# Altium project SBC RK3368.PrjPcb
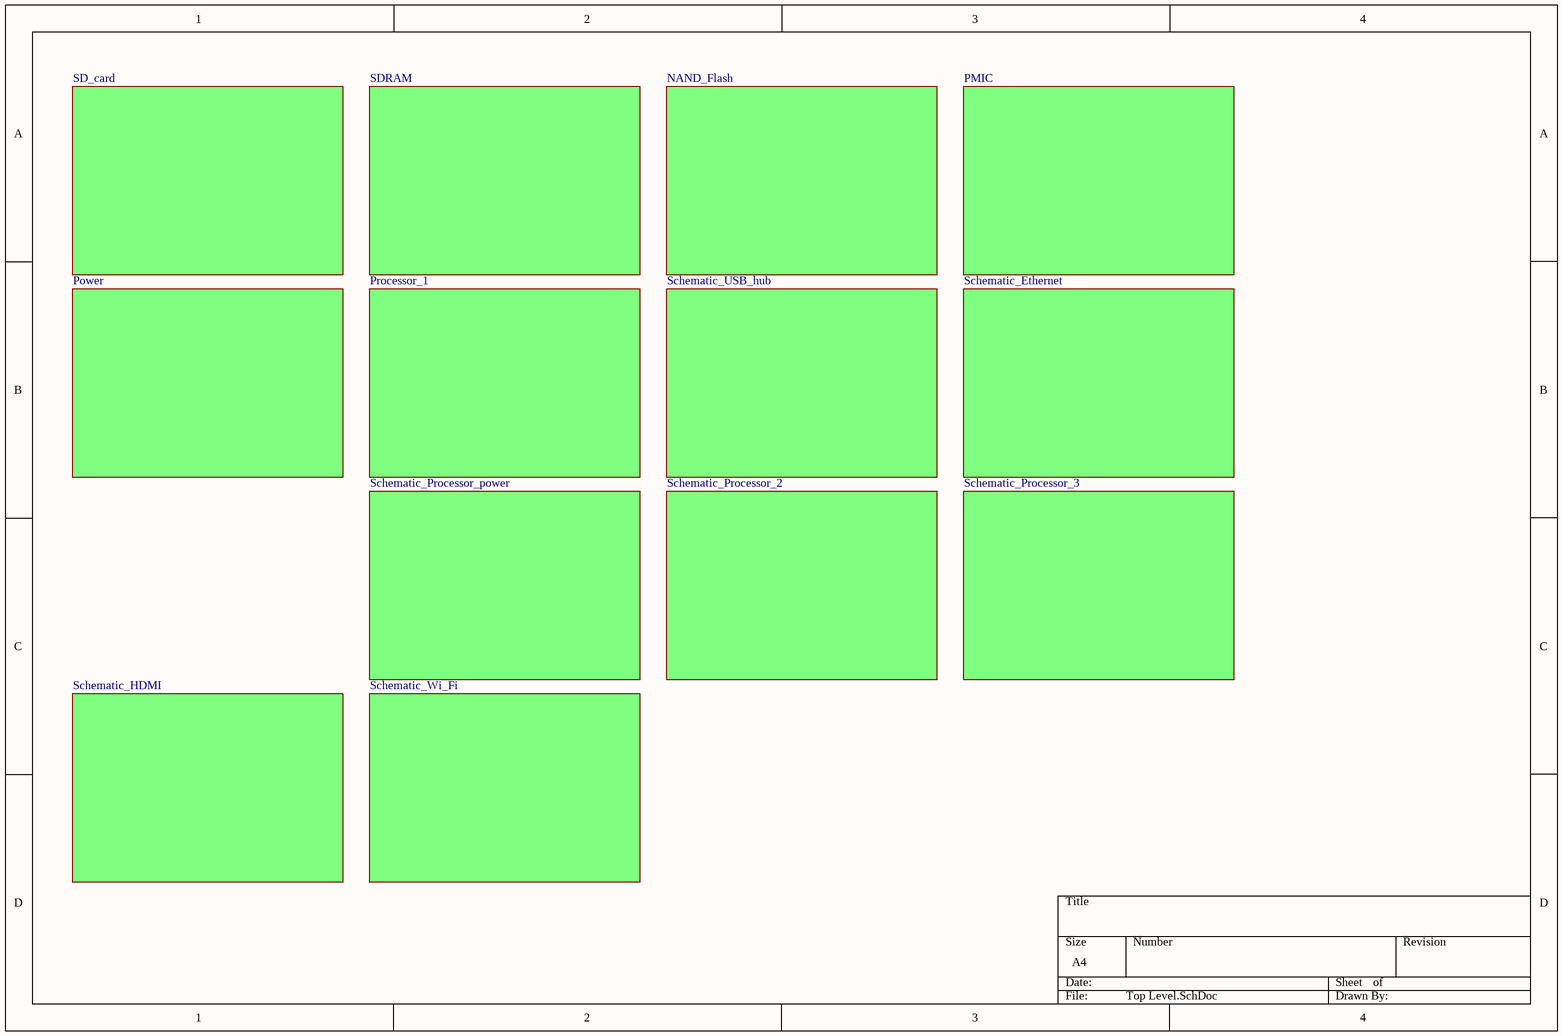
[diagram p0: Top Level.SchDoc]
14 sheets, 49 parts. Net scope: global (net labels, ports and power ports of the same name join across sheets).
Board file: SBC A33.PcbDoc
Sheets:
  Top Level.SchDoc
    SD_card = SD_card.SchDoc
    SDRAM = SDRAM.SchDoc
    NAND_Flash = NAND_Flash.SchDoc
    PMIC = PMIC.SchDoc
    Power = Power.SchDoc
    Processor_1 = Processor_1.SchDoc
    Schematic_USB_hub = USB_hub.SchDoc
    Schematic_Ethernet = Ethernet.SchDoc
    Schematic_Processor_power = Processor_power.SchDoc
    Schematic_Processor_2 = Processor_2.SchDoc
    Schematic_Processor_3 = Processor_3.SchDoc
    Schematic_HDMI = HDMI.SchDoc
    Schematic_Wi_Fi = Wi_Fi.SchDoc

## Sheet Top Level.SchDoc
size A4; SheetNumber: 1; SheetTotal: 14

### Sub-sheets
NAND_Flash = NAND_Flash.SchDoc: no entries
PMIC = PMIC.SchDoc: no entries
Power = Power.SchDoc: no entries
Processor_1 = Processor_1.SchDoc: no entries
Schematic_Ethernet = Ethernet.SchDoc: no entries
Schematic_HDMI = HDMI.SchDoc: no entries
Schematic_Processor_2 = Processor_2.SchDoc: no entries
Schematic_Processor_3 = Processor_3.SchDoc: no entries
Schematic_Processor_power = Processor_power.SchDoc: no entries
Schematic_USB_hub = USB_hub.SchDoc: no entries
Schematic_Wi_Fi = Wi_Fi.SchDoc: no entries
SD_card = SD_card.SchDoc: no entries
SDRAM = SDRAM.SchDoc: no entries

## Sheet SD_card.SchDoc
size 209 x 297 mm; CmpIndex: 71; SymIndex: 29
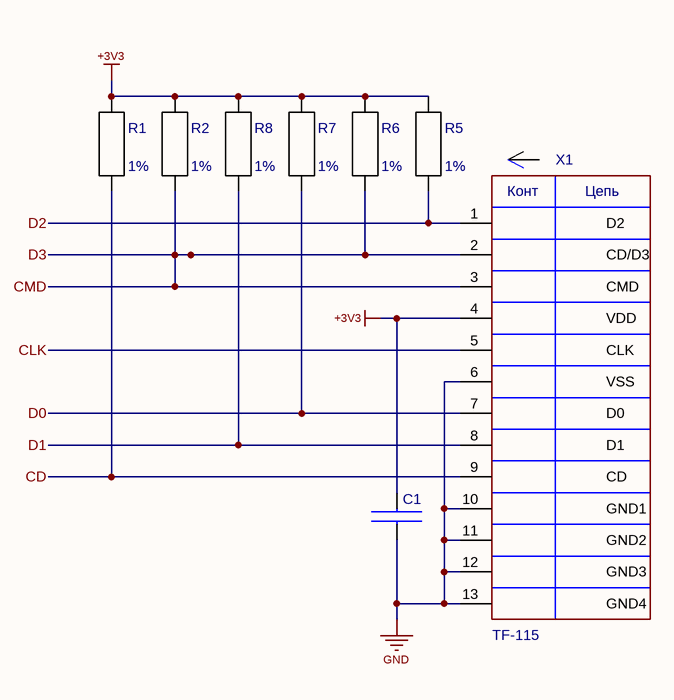
[diagram p1: SD_card.SchDoc]

### Parts
C1  0402-0.1uF-50V-10%-X7R  (value not drawn)
R1  Tolerance: 1%  (hidden comment: 0402-10k-1%-1/16 W-100ppm)
R2  Tolerance: 1%  (hidden comment: 0402-10k-1%-1/16 W-100ppm)
R5  Tolerance: 1%  (hidden comment: 0402-100k-1%-1/16 W-100ppm)
R6  Tolerance: 1%  (hidden comment: 0402-100k-1%-1/16 W-100ppm)
R7  Tolerance: 1%  (hidden comment: 0402-100k-1%-1/16 W-100ppm)
R8  Tolerance: 1%  (hidden comment: 0402-100k-1%-1/16 W-100ppm)
X1  TF-115

### Nets
+3V3: C1.2 R1.2 R2.2 R5.2 R6.2 R7.2 R8.2 X1.4(VDD)
GND: C1.1 X1.6(VSS) X1.10(GND1) X1.11(GND2) X1.12(GND3) X1.13(GND4)
CD: R1.1 X1.9(CD)
CLK: X1.5(CLK)
CMD: R2.1 R6.1 X1.2(CD/D3) X1.3(CMD)  [also labelled D3]
D0: R7.1 X1.7(D0)
D1: R8.1 X1.8(D1)
D2: R5.1 X1.1(D2)

### Notes on the sheet
- Лист
- Изм.
- № Докум.
- Подп.
- Дата
- (in symbol TF-115) Конт; Цепь

### Library data of the parts
C1 = 0402-0.1uF-50V-10%-X7R: Cell Name: 0402_CAPC100X50X55L25N; CmpIndex: 9; DXDB_LIBNAME: Capacitors Ceramic SMD; Ref Designator: C1; SymIndex: 25; Tolerance: 10%; Orientation: 1 = 1; Part Label: 0402-0.1uF-50V-10%-X7R; Part Name: 0402-0.1uF-50V-10%-X7R; Part Number NP: 0402-0.1uF-50V-10%-X7R; Part Number: 0402-0.1uF-50V-10%-X7R
R1 = 0402-10k-1%-1/16 W-100ppm: Cell Name: 0402_RESC100X50X35L25N; CmpIndex: 10; DXDB_LIBNAME: Resistors Surface Mount; Ref Designator: R1; SymIndex: 13; Orientation: 1 = 1; Part Label: 0402-10k-1%-1/16 W-100ppm; Part Name: 0402-10k-1%-1/16 W-100ppm; Part Number NP: 0402-10k-1%-1/16 W-100ppm; Part Number: 0402-10k-1%-1/16 W-100ppm
R2 = 0402-10k-1%-1/16 W-100ppm: Cell Name: 0402_RESC100X50X35L25N; CmpIndex: 11; DXDB_LIBNAME: Resistors Surface Mount; Ref Designator: R2; SymIndex: 13; Orientation: 1 = 1; Part Label: 0402-10k-1%-1/16 W-100ppm; Part Name: 0402-10k-1%-1/16 W-100ppm; Part Number NP: 0402-10k-1%-1/16 W-100ppm; Part Number: 0402-10k-1%-1/16 W-100ppm
R5 = 0402-100k-1%-1/16 W-100ppm: Cell Name: 0402_RESC100X50X35L25N; CmpIndex: 12; DXDB_LIBNAME: Resistors Surface Mount; Ref Designator: R5; SymIndex: 13; Orientation: 1 = 1; Part Label: 0402-100k-1%-1/16 W-100ppm; Part Name: 0402-100k-1%-1/16 W-100ppm; Part Number NP: 0402-100k-1%-1/16 W-100ppm; Part Number: 0402-100k-1%-1/16 W-100ppm
R6 = 0402-100k-1%-1/16 W-100ppm: Cell Name: 0402_RESC100X50X35L25N; CmpIndex: 13; DXDB_LIBNAME: Resistors Surface Mount; Ref Designator: R6; Orientation: 1 = 1; Part Label: 0402-100k-1%-1/16 W-100ppm; Part Name: 0402-100k-1%-1/16 W-100ppm; Part Number NP: 0402-100k-1%-1/16 W-100ppm; Part Number: 0402-100k-1%-1/16 W-100ppm; SymIndex: 13
R7 = 0402-100k-1%-1/16 W-100ppm: Cell Name: 0402_RESC100X50X35L25N; CmpIndex: 14; DXDB_LIBNAME: Resistors Surface Mount; Ref Designator: R7; SymIndex: 13; Orientation: 1 = 1; Part Label: 0402-100k-1%-1/16 W-100ppm; Part Name: 0402-100k-1%-1/16 W-100ppm; Part Number NP: 0402-100k-1%-1/16 W-100ppm; Part Number: 0402-100k-1%-1/16 W-100ppm
R8 = 0402-100k-1%-1/16 W-100ppm: Cell Name: 0402_RESC100X50X35L25N; CmpIndex: 15; DXDB_LIBNAME: Resistors Surface Mount; Ref Designator: R8; SymIndex: 13; Orientation: 1 = 1; Part Label: 0402-100k-1%-1/16 W-100ppm; Part Name: 0402-100k-1%-1/16 W-100ppm; Part Number NP: 0402-100k-1%-1/16 W-100ppm; Part Number: 0402-100k-1%-1/16 W-100ppm
X1 = TF-115: Cell Name: TF-115 SD card; CmpIndex: 0; Ref Designator: X1; Orientation: 0 = 0; Part Label: TF-115; Part Name: TF-115; Part Number: TF-115; SymIndex: 0

## Sheet SDRAM.SchDoc
size 297 x 420 mm; CmpIndex: 72; SymIndex: 41
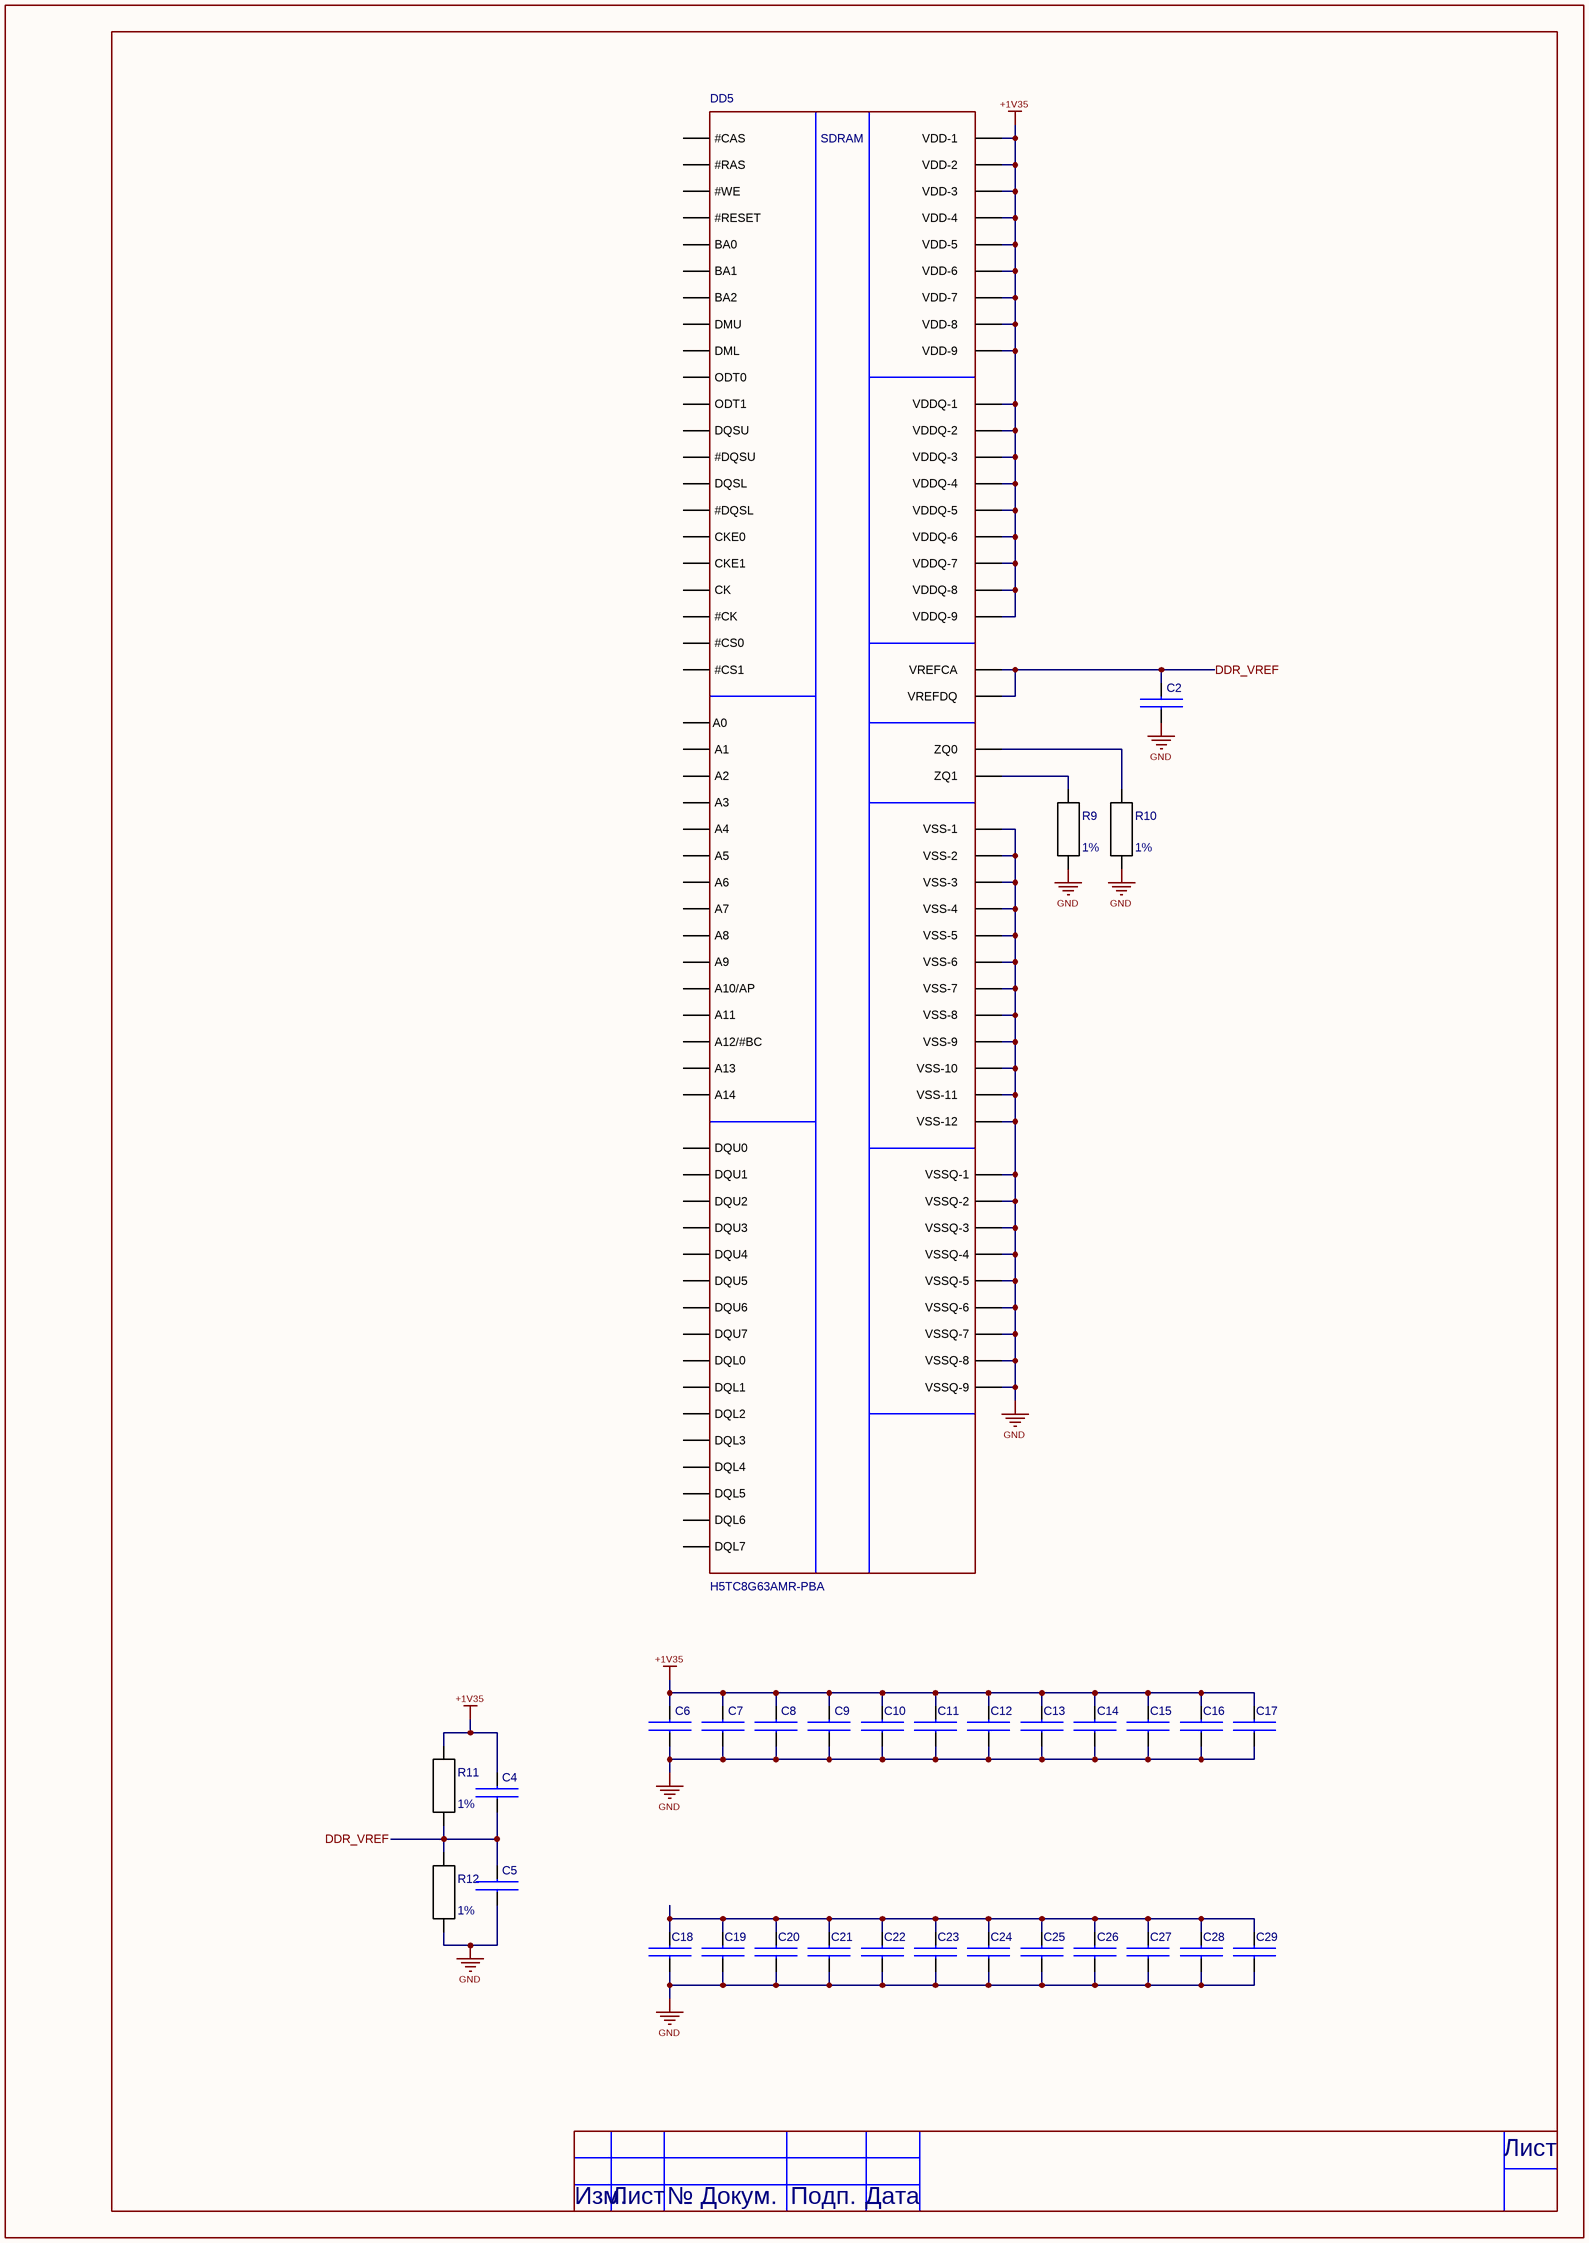
[diagram p2: SDRAM.SchDoc]

### Parts
C2  0402-0.1uF-50V-10%-X7R  (value not drawn)
C4  0402-0.1uF-50V-10%-X7R  (value not drawn)
C5  0402-0.1uF-50V-10%-X7R  (value not drawn)
C6  0402-0.1uF-50V-10%-X7R  (value not drawn)
C7  0402-0.1uF-50V-10%-X7R  (value not drawn)
C8  0402-0.1uF-50V-10%-X7R  (value not drawn)
C9  0402-0.1uF-50V-10%-X7R  (value not drawn)
C10  0402-0.1uF-50V-10%-X7R  (value not drawn)
C11  0402-0.1uF-50V-10%-X7R  (value not drawn)
C12  0402-0.1uF-50V-10%-X7R  (value not drawn)
C13  0402-0.1uF-50V-10%-X7R  (value not drawn)
C14  0402-0.1uF-50V-10%-X7R  (value not drawn)
C15  0402-0.1uF-50V-10%-X7R  (value not drawn)
C16  0402-0.1uF-50V-10%-X7R  (value not drawn)
C17  0402-0.1uF-50V-10%-X7R  (value not drawn)
C18  0402-0.1uF-50V-10%-X7R  (value not drawn)
C19  0402-0.1uF-50V-10%-X7R  (value not drawn)
C20  0402-0.1uF-50V-10%-X7R  (value not drawn)
C21  0402-0.1uF-50V-10%-X7R  (value not drawn)
C22  0402-0.1uF-50V-10%-X7R  (value not drawn)
C23  0402-0.1uF-50V-10%-X7R  (value not drawn)
C24  0402-0.1uF-50V-10%-X7R  (value not drawn)
C25  0402-0.1uF-50V-10%-X7R  (value not drawn)
C26  0402-0.1uF-50V-10%-X7R  (value not drawn)
C27  0402-0.1uF-50V-10%-X7R  (value not drawn)
C28  0402-0.1uF-50V-10%-X7R  (value not drawn)
C29  0402-0.1uF-50V-10%-X7R  (value not drawn)
DD5  H5TC8G63AMR-PBA
R9  Tolerance: 1%  (hidden comment: 0402-243R-1%-1/16 W-100ppm)
R10  Tolerance: 1%  (hidden comment: 0402-243R-1%-1/16 W-100ppm)
R11  Tolerance: 1%  (hidden comment: 0402-2k-1%-1/16 W-100ppm)
R12  Tolerance: 1%  (hidden comment: 0402-2k-1%-1/16 W-100ppm)

### Nets
+1V35: C4.2 C6.2 C7.2 C8.2 C9.2 C10.2 C11.2 C12.2 C13.2 C14.2 C15.2 C16.2 C17.2 DD5.A1(VDDQ-1) DD5.A8(VDDQ-6) DD5.B2(VDD-3) DD5.C1(VDDQ-2) DD5.C9(VDDQ-7) DD5.D2(VDDQ-4) DD5.D9(VDD-7) DD5.E9(VDDQ-8) DD5.F1(VDDQ-3) DD5.G7(VDD-5) DD5.H2(VDDQ-5) DD5.H9(VDDQ-9) DD5.K2(VDD-4) DD5.K8(VDD-6) DD5.N1(VDD-1) DD5.N9(VDD-8) DD5.R1(VDD-2) DD5.R9(VDD-9) R11.2
GND: C2.1 C5.1 C6.1 C7.1 C8.1 C9.1 C10.1 C11.1 C12.1 C13.1 C14.1 C15.1 C16.1 C17.1 C18.1 C19.1 C20.1 C21.1 C22.1 C23.1 C24.1 C25.1 C26.1 C27.1 C28.1 C29.1 DD5.A9(VSS-9) DD5.B1(VSSQ-1) DD5.B3(VSS-6) DD5.B9(VSSQ-7) DD5.D1(VSSQ-2) DD5.D8(VSSQ-5) DD5.E1(VSS-1) DD5.E2(VSSQ-4) DD5.E8(VSSQ-6) DD5.F9(VSSQ-8) DD5.G1(VSSQ-3) DD5.G8(VSS-7) DD5.G9(VSSQ-9) DD5.J2(VSS-5) DD5.J8(VSS-8) DD5.M1(VSS-2) DD5.M9(VSS-10) DD5.P1(VSS-3) DD5.P9(VSS-11) DD5.T1(VSS-4) DD5.T9(VSS-12) R9.2 R10.2 R12.1
DDR_VREF: C2.2 C4.1 C5.2 DD5.H1(VREFDQ) DD5.M8(VREFCA) R11.1 R12.2
NetC18_2: C18.2 C19.2 C20.2 C21.2 C22.2 C23.2 C24.2 C25.2 C26.2 C27.2 C28.2 C29.2
NetDD5_L8: DD5.L8(ZQ0) R10.1
NetDD5_L9: DD5.L9(ZQ1) R9.1

Not connected (* = marked no-connect by the designer): DD5 A2(DQU5) A3(DQU7) A7(DQU4) B7(#DQSU) B8(DQU6) C2(DQU3) C3(DQU1) C7(DQSU) C8(DQU2) D3(DMU) D7(DQU0) E3(DQL0) E7(DML) F2(DQL2) F3(DQSL) F7(DQL1) F8(DQL3) G2(DQL6) G3(#DQSL) H3(DQL4) H7(DQL7) H8(DQL5) J1(ODT1) J3(#RAS) J7(CK) J9(CKE1) K1(ODT0) K3(#CAS) K7(#CK) K9(CKE0) L1(#CS1) L2(#CS0) L3(#WE) L7(A10/AP) M2(BA0) M3(BA2) N2(A3) N3(A0) N7(A12/#BC) N8(BA1) P2(A5) P3(A2) P7(A1) P8(A4) R2(A7) R3(A9) R7(A11) R8(A6) T2(#RESET) T3(A13) T7(A14) T8(A8)

### Notes on the sheet
- Лист
- Изм.
- № Докум.
- Подп.
- Дата
- (in symbol H5TC8G63AMR-PBA) SDRAM

### Library data of the parts
C2 = 0402-0.1uF-50V-10%-X7R: Cell Name: 0402_CAPC100X50X55L25N; CmpIndex: 25; DXDB_LIBNAME: Capacitors Ceramic SMD; Ref Designator: C2; Tolerance: 10%; Orientation: 7 = 7; Part Label: 0402-0.1uF-50V-10%-X7R; Part Name: 0402-0.1uF-50V-10%-X7R; Part Number NP: 0402-0.1uF-50V-10%-X7R; Part Number: 0402-0.1uF-50V-10%-X7R; SymIndex: 25
C4 = 0402-0.1uF-50V-10%-X7R: Cell Name: 0402_CAPC100X50X55L25N; CmpIndex: 34; DXDB_LIBNAME: Capacitors Ceramic SMD; Ref Designator: C4; SymIndex: 25; Tolerance: 10%; Orientation: 1 = 1; Part Label: 0402-0.1uF-50V-10%-X7R; Part Name: 0402-0.1uF-50V-10%-X7R; Part Number NP: 0402-0.1uF-50V-10%-X7R; Part Number: 0402-0.1uF-50V-10%-X7R
C5 = 0402-0.1uF-50V-10%-X7R: Cell Name: 0402_CAPC100X50X55L25N; CmpIndex: 35; DXDB_LIBNAME: Capacitors Ceramic SMD; Ref Designator: C5; SymIndex: 25; Tolerance: 10%; Orientation: 1 = 1; Part Label: 0402-0.1uF-50V-10%-X7R; Part Name: 0402-0.1uF-50V-10%-X7R; Part Number NP: 0402-0.1uF-50V-10%-X7R; Part Number: 0402-0.1uF-50V-10%-X7R
C6 = 0402-0.1uF-50V-10%-X7R: Cell Name: 0402_CAPC100X50X55L25N; CmpIndex: 43; DXDB_LIBNAME: Capacitors Ceramic SMD; Ref Designator: C6; SymIndex: 25; Tolerance: 10%; Orientation: 1 = 1; Part Label: 0402-0.1uF-50V-10%-X7R; Part Name: 0402-0.1uF-50V-10%-X7R; Part Number NP: 0402-0.1uF-50V-10%-X7R; Part Number: 0402-0.1uF-50V-10%-X7R
C7 = 0402-0.1uF-50V-10%-X7R: Cell Name: 0402_CAPC100X50X55L25N; CmpIndex: 46; DXDB_LIBNAME: Capacitors Ceramic SMD; Ref Designator: C7; SymIndex: 25; Tolerance: 10%; Orientation: 1 = 1; Part Label: 0402-0.1uF-50V-10%-X7R; Part Name: 0402-0.1uF-50V-10%-X7R; Part Number NP: 0402-0.1uF-50V-10%-X7R; Part Number: 0402-0.1uF-50V-10%-X7R
C8 = 0402-0.1uF-50V-10%-X7R: Cell Name: 0402_CAPC100X50X55L25N; CmpIndex: 47; DXDB_LIBNAME: Capacitors Ceramic SMD; Ref Designator: C8; SymIndex: 25; Tolerance: 10%; Orientation: 1 = 1; Part Label: 0402-0.1uF-50V-10%-X7R; Part Name: 0402-0.1uF-50V-10%-X7R; Part Number NP: 0402-0.1uF-50V-10%-X7R; Part Number: 0402-0.1uF-50V-10%-X7R
C9 = 0402-0.1uF-50V-10%-X7R: Cell Name: 0402_CAPC100X50X55L25N; CmpIndex: 48; DXDB_LIBNAME: Capacitors Ceramic SMD; Ref Designator: C9; SymIndex: 25; Tolerance: 10%; Orientation: 1 = 1; Part Label: 0402-0.1uF-50V-10%-X7R; Part Name: 0402-0.1uF-50V-10%-X7R; Part Number NP: 0402-0.1uF-50V-10%-X7R; Part Number: 0402-0.1uF-50V-10%-X7R
C10 = 0402-0.1uF-50V-10%-X7R: Cell Name: 0402_CAPC100X50X55L25N; CmpIndex: 49; DXDB_LIBNAME: Capacitors Ceramic SMD; Ref Designator: C10; SymIndex: 25; Tolerance: 10%; Orientation: 1 = 1; Part Label: 0402-0.1uF-50V-10%-X7R; Part Name: 0402-0.1uF-50V-10%-X7R; Part Number NP: 0402-0.1uF-50V-10%-X7R; Part Number: 0402-0.1uF-50V-10%-X7R
C11 = 0402-0.1uF-50V-10%-X7R: Cell Name: 0402_CAPC100X50X55L25N; CmpIndex: 50; DXDB_LIBNAME: Capacitors Ceramic SMD; Ref Designator: C11; SymIndex: 25; Tolerance: 10%; Orientation: 1 = 1; Part Label: 0402-0.1uF-50V-10%-X7R; Part Name: 0402-0.1uF-50V-10%-X7R; Part Number NP: 0402-0.1uF-50V-10%-X7R; Part Number: 0402-0.1uF-50V-10%-X7R
C12 = 0402-0.1uF-50V-10%-X7R: Cell Name: 0402_CAPC100X50X55L25N; CmpIndex: 56; DXDB_LIBNAME: Capacitors Ceramic SMD; Ref Designator: C12; SymIndex: 25; Tolerance: 10%; Orientation: 1 = 1; Part Label: 0402-0.1uF-50V-10%-X7R; Part Name: 0402-0.1uF-50V-10%-X7R; Part Number NP: 0402-0.1uF-50V-10%-X7R; Part Number: 0402-0.1uF-50V-10%-X7R
C13 = 0402-0.1uF-50V-10%-X7R: Cell Name: 0402_CAPC100X50X55L25N; CmpIndex: 55; DXDB_LIBNAME: Capacitors Ceramic SMD; Ref Designator: C13; SymIndex: 25; Tolerance: 10%; Orientation: 1 = 1; Part Label: 0402-0.1uF-50V-10%-X7R; Part Name: 0402-0.1uF-50V-10%-X7R; Part Number NP: 0402-0.1uF-50V-10%-X7R; Part Number: 0402-0.1uF-50V-10%-X7R
C14 = 0402-0.1uF-50V-10%-X7R: Cell Name: 0402_CAPC100X50X55L25N; CmpIndex: 54; DXDB_LIBNAME: Capacitors Ceramic SMD; Ref Designator: C14; SymIndex: 25; Tolerance: 10%; Orientation: 1 = 1; Part Label: 0402-0.1uF-50V-10%-X7R; Part Name: 0402-0.1uF-50V-10%-X7R; Part Number NP: 0402-0.1uF-50V-10%-X7R; Part Number: 0402-0.1uF-50V-10%-X7R
C15 = 0402-0.1uF-50V-10%-X7R: Cell Name: 0402_CAPC100X50X55L25N; CmpIndex: 53; DXDB_LIBNAME: Capacitors Ceramic SMD; Ref Designator: C15; SymIndex: 25; Tolerance: 10%; Orientation: 1 = 1; Part Label: 0402-0.1uF-50V-10%-X7R; Part Name: 0402-0.1uF-50V-10%-X7R; Part Number NP: 0402-0.1uF-50V-10%-X7R; Part Number: 0402-0.1uF-50V-10%-X7R
C16 = 0402-0.1uF-50V-10%-X7R: Cell Name: 0402_CAPC100X50X55L25N; CmpIndex: 52; DXDB_LIBNAME: Capacitors Ceramic SMD; Ref Designator: C16; SymIndex: 25; Tolerance: 10%; Orientation: 1 = 1; Part Label: 0402-0.1uF-50V-10%-X7R; Part Name: 0402-0.1uF-50V-10%-X7R; Part Number NP: 0402-0.1uF-50V-10%-X7R; Part Number: 0402-0.1uF-50V-10%-X7R
C17 = 0402-0.1uF-50V-10%-X7R: Cell Name: 0402_CAPC100X50X55L25N; CmpIndex: 51; DXDB_LIBNAME: Capacitors Ceramic SMD; Ref Designator: C17; SymIndex: 25; Tolerance: 10%; Orientation: 1 = 1; Part Label: 0402-0.1uF-50V-10%-X7R; Part Name: 0402-0.1uF-50V-10%-X7R; Part Number NP: 0402-0.1uF-50V-10%-X7R; Part Number: 0402-0.1uF-50V-10%-X7R
C18 = 0402-0.1uF-50V-10%-X7R: Cell Name: 0402_CAPC100X50X55L25N; CmpIndex: 70; DXDB_LIBNAME: Capacitors Ceramic SMD; Ref Designator: C18; SymIndex: 25; Tolerance: 10%; Orientation: 1 = 1; Part Label: 0402-0.1uF-50V-10%-X7R; Part Name: 0402-0.1uF-50V-10%-X7R; Part Number NP: 0402-0.1uF-50V-10%-X7R; Part Number: 0402-0.1uF-50V-10%-X7R
C19 = 0402-0.1uF-50V-10%-X7R: Cell Name: 0402_CAPC100X50X55L25N; CmpIndex: 67; DXDB_LIBNAME: Capacitors Ceramic SMD; Ref Designator: C19; SymIndex: 25; Tolerance: 10%; Orientation: 1 = 1; Part Label: 0402-0.1uF-50V-10%-X7R; Part Name: 0402-0.1uF-50V-10%-X7R; Part Number NP: 0402-0.1uF-50V-10%-X7R; Part Number: 0402-0.1uF-50V-10%-X7R
C20 = 0402-0.1uF-50V-10%-X7R: Cell Name: 0402_CAPC100X50X55L25N; CmpIndex: 66; DXDB_LIBNAME: Capacitors Ceramic SMD; Ref Designator: C20; SymIndex: 25; Tolerance: 10%; Orientation: 1 = 1; Part Label: 0402-0.1uF-50V-10%-X7R; Part Name: 0402-0.1uF-50V-10%-X7R; Part Number NP: 0402-0.1uF-50V-10%-X7R; Part Number: 0402-0.1uF-50V-10%-X7R
C21 = 0402-0.1uF-50V-10%-X7R: Cell Name: 0402_CAPC100X50X55L25N; CmpIndex: 65; DXDB_LIBNAME: Capacitors Ceramic SMD; Ref Designator: C21; SymIndex: 25; Tolerance: 10%; Orientation: 1 = 1; Part Label: 0402-0.1uF-50V-10%-X7R; Part Name: 0402-0.1uF-50V-10%-X7R; Part Number NP: 0402-0.1uF-50V-10%-X7R; Part Number: 0402-0.1uF-50V-10%-X7R
C22 = 0402-0.1uF-50V-10%-X7R: Cell Name: 0402_CAPC100X50X55L25N; CmpIndex: 64; DXDB_LIBNAME: Capacitors Ceramic SMD; Ref Designator: C22; SymIndex: 25; Tolerance: 10%; Orientation: 1 = 1; Part Label: 0402-0.1uF-50V-10%-X7R; Part Name: 0402-0.1uF-50V-10%-X7R; Part Number NP: 0402-0.1uF-50V-10%-X7R; Part Number: 0402-0.1uF-50V-10%-X7R
C23 = 0402-0.1uF-50V-10%-X7R: Cell Name: 0402_CAPC100X50X55L25N; CmpIndex: 63; DXDB_LIBNAME: Capacitors Ceramic SMD; Ref Designator: C23; SymIndex: 25; Tolerance: 10%; Orientation: 1 = 1; Part Label: 0402-0.1uF-50V-10%-X7R; Part Name: 0402-0.1uF-50V-10%-X7R; Part Number NP: 0402-0.1uF-50V-10%-X7R; Part Number: 0402-0.1uF-50V-10%-X7R
C24 = 0402-0.1uF-50V-10%-X7R: Cell Name: 0402_CAPC100X50X55L25N; CmpIndex: 62; DXDB_LIBNAME: Capacitors Ceramic SMD; Ref Designator: C24; SymIndex: 25; Tolerance: 10%; Orientation: 1 = 1; Part Label: 0402-0.1uF-50V-10%-X7R; Part Name: 0402-0.1uF-50V-10%-X7R; Part Number NP: 0402-0.1uF-50V-10%-X7R; Part Number: 0402-0.1uF-50V-10%-X7R
C25 = 0402-0.1uF-50V-10%-X7R: Cell Name: 0402_CAPC100X50X55L25N; CmpIndex: 61; DXDB_LIBNAME: Capacitors Ceramic SMD; Ref Designator: C25; SymIndex: 25; Tolerance: 10%; Orientation: 1 = 1; Part Label: 0402-0.1uF-50V-10%-X7R; Part Name: 0402-0.1uF-50V-10%-X7R; Part Number NP: 0402-0.1uF-50V-10%-X7R; Part Number: 0402-0.1uF-50V-10%-X7R
C26 = 0402-0.1uF-50V-10%-X7R: Cell Name: 0402_CAPC100X50X55L25N; CmpIndex: 60; DXDB_LIBNAME: Capacitors Ceramic SMD; Ref Designator: C26; SymIndex: 25; Tolerance: 10%; Orientation: 1 = 1; Part Label: 0402-0.1uF-50V-10%-X7R; Part Name: 0402-0.1uF-50V-10%-X7R; Part Number NP: 0402-0.1uF-50V-10%-X7R; Part Number: 0402-0.1uF-50V-10%-X7R
C27 = 0402-0.1uF-50V-10%-X7R: Cell Name: 0402_CAPC100X50X55L25N; CmpIndex: 59; DXDB_LIBNAME: Capacitors Ceramic SMD; Ref Designator: C27; SymIndex: 25; Tolerance: 10%; Orientation: 1 = 1; Part Label: 0402-0.1uF-50V-10%-X7R; Part Name: 0402-0.1uF-50V-10%-X7R; Part Number NP: 0402-0.1uF-50V-10%-X7R; Part Number: 0402-0.1uF-50V-10%-X7R
C28 = 0402-0.1uF-50V-10%-X7R: Cell Name: 0402_CAPC100X50X55L25N; CmpIndex: 58; DXDB_LIBNAME: Capacitors Ceramic SMD; Ref Designator: C28; SymIndex: 25; Tolerance: 10%; Orientation: 1 = 1; Part Label: 0402-0.1uF-50V-10%-X7R; Part Name: 0402-0.1uF-50V-10%-X7R; Part Number NP: 0402-0.1uF-50V-10%-X7R; Part Number: 0402-0.1uF-50V-10%-X7R
C29 = 0402-0.1uF-50V-10%-X7R: Cell Name: 0402_CAPC100X50X55L25N; CmpIndex: 57; DXDB_LIBNAME: Capacitors Ceramic SMD; Ref Designator: C29; SymIndex: 25; Tolerance: 10%; Orientation: 1 = 1; Part Label: 0402-0.1uF-50V-10%-X7R; Part Name: 0402-0.1uF-50V-10%-X7R; Part Number NP: 0402-0.1uF-50V-10%-X7R; Part Number: 0402-0.1uF-50V-10%-X7R
DD5 = H5TC8G63AMR-PBA: CmpIndex: 1; DXDB_LIBNAME: Memory SDRAM; Ref Designator: DD5; SymIndex: 40; Orientation: 0 = 0; Part Label: H5TC8G63AMR-PBA; Part Name: H5TC8G63AMR-PBA; Part Number NP: H5TC8G63AMR-PBA; Part Number: H5TC8G63AMR-PBA
R9 = 0402-243R-1%-1/16 W-100ppm: Cell Name: 0402_RESC100X50X35L25N; CmpIndex: 23; DXDB_LIBNAME: Resistors Surface Mount; Ref Designator: R9; SymIndex: 13; Orientation: 5 = 5; Part Label: 0402-243R-1%-1/16 W-100ppm; Part Name: 0402-243R-1%-1/16 W-100ppm; Part Number NP: 0402-243R-1%-1/16 W-100ppm; Part Number: 0402-243R-1%-1/16 W-100ppm
R10 = 0402-243R-1%-1/16 W-100ppm: Cell Name: 0402_RESC100X50X35L25N; CmpIndex: 32; DXDB_LIBNAME: Resistors Surface Mount; Ref Designator: R10; SymIndex: 13; Orientation: 3 = 3; Part Label: 0402-243R-1%-1/16 W-100ppm; Part Name: 0402-243R-1%-1/16 W-100ppm; Part Number NP: 0402-243R-1%-1/16 W-100ppm; Part Number: 0402-243R-1%-1/16 W-100ppm
R11 = 0402-2k-1%-1/16 W-100ppm: Cell Name: 0402_RESC100X50X35L25N; CmpIndex: 36; DXDB_LIBNAME: Resistors Surface Mount; Ref Designator: R11; SymIndex: 13; Orientation: 1 = 1; Part Label: 0402-2k-1%-1/16 W-100ppm; Part Name: 0402-2k-1%-1/16 W-100ppm; Part Number NP: 0402-2k-1%-1/16 W-100ppm; Part Number: 0402-2k-1%-1/16 W-100ppm
R12 = 0402-2k-1%-1/16 W-100ppm: Cell Name: 0402_RESC100X50X35L25N; CmpIndex: 37; DXDB_LIBNAME: Resistors Surface Mount; Ref Designator: R12; SymIndex: 13; Orientation: 1 = 1; Part Label: 0402-2k-1%-1/16 W-100ppm; Part Name: 0402-2k-1%-1/16 W-100ppm; Part Number NP: 0402-2k-1%-1/16 W-100ppm; Part Number: 0402-2k-1%-1/16 W-100ppm

## Sheet NAND_Flash.SchDoc
size 209 x 297 mm; SheetNumber: 4; SheetTotal: 14; CmpIndex: 73; SymIndex: 29
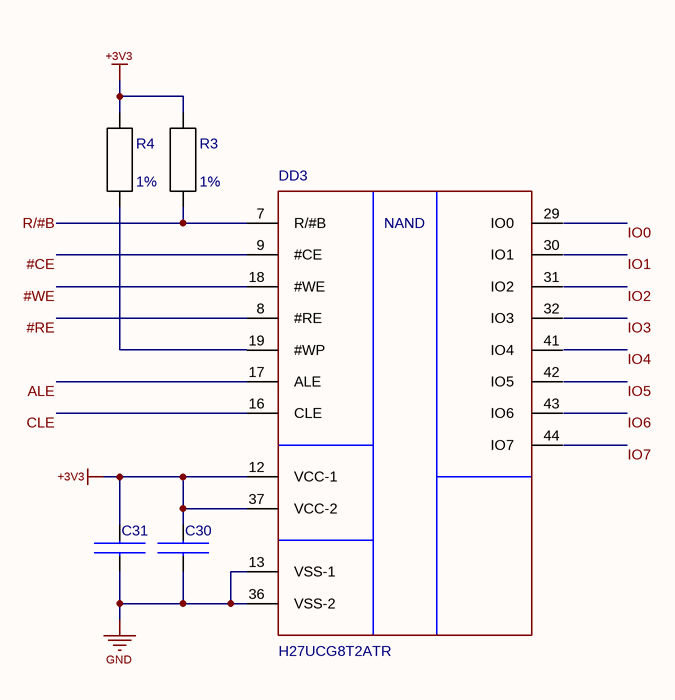
[diagram p3: NAND_Flash.SchDoc]

### Parts
C30  0402-0.1uF-50V-10%-X7R  (value not drawn)
C31  0402-0.1uF-50V-10%-X7R  (value not drawn)
DD3  H27UCG8T2ATR
R3  Tolerance: 1%  (hidden comment: 0402-10k-1%-1/16 W-100ppm)
R4  Tolerance: 1%  (hidden comment: 0402-10k-1%-1/16 W-100ppm)

### Nets
+3V3: C30.2 C31.2 DD3.12(VCC-1) DD3.37(VCC-2) R3.2 R4.2
GND: C30.1 C31.1 DD3.13(VSS-1) DD3.36(VSS-2)
#CE: DD3.9(#CE)
#RE: DD3.8(#RE)
#WE: DD3.18(#WE)
ALE: DD3.17(ALE)
CLE: DD3.16(CLE)
IO0: DD3.29(IO0)
IO1: DD3.30(IO1)
IO2: DD3.31(IO2)
IO3: DD3.32(IO3)
IO4: DD3.41(IO4)
IO5: DD3.42(IO5)
IO6: DD3.43(IO6)
IO7: DD3.44(IO7)
R/#B: DD3.7(R/#B) R3.1
NetDD3_19: DD3.19(#WP) R4.1

### Notes on the sheet
- Лист
- Изм.
- № Докум.
- Подп.
- Дата
- (in symbol H27UCG8T2ATR) NAND

### Library data of the parts
C30 = 0402-0.1uF-50V-10%-X7R: Cell Name: 0402_CAPC100X50X55L25N; CmpIndex: 19; Ref Designator: C30; SymIndex: 25; Tolerance: 10%; Orientation: 1 = 1; Part Label: 0402-0.1uF-50V-10%-X7R; Part Name: 0402-0.1uF-50V-10%-X7R; Part Number NP: 0402-0.1uF-50V-10%-X7R; Part Number: 0402-0.1uF-50V-10%-X7R
C31 = 0402-0.1uF-50V-10%-X7R: Cell Name: 0402_CAPC100X50X55L25N; CmpIndex: 20; Ref Designator: C31; SymIndex: 25; Tolerance: 10%; Orientation: 1 = 1; Part Label: 0402-0.1uF-50V-10%-X7R; Part Name: 0402-0.1uF-50V-10%-X7R; Part Number NP: 0402-0.1uF-50V-10%-X7R; Part Number: 0402-0.1uF-50V-10%-X7R
DD3 = H27UCG8T2ATR: CmpIndex: 6; DXDB_LIBNAME: Memory NAND; Ref Designator: DD3; SymIndex: 11; Orientation: 0 = 0; Part Label: H27UCG8T2ATR; Part Name: H27UCG8T2ATR; Part Number NP: H27UCG8T2ATR; Part Number: H27UCG8T2ATR
R3 = 0402-10k-1%-1/16 W-100ppm: Cell Name: 0402_RESC100X50X35L25N; CmpIndex: 4; DXDB_LIBNAME: Resistors Surface Mount; Ref Designator: R3; SymIndex: 13; Orientation: 1 = 1; Part Label: 0402-10k-1%-1/16 W-100ppm; Part Name: 0402-10k-1%-1/16 W-100ppm; Part Number NP: 0402-10k-1%-1/16 W-100ppm; Part Number: 0402-10k-1%-1/16 W-100ppm
R4 = 0402-10k-1%-1/16 W-100ppm: Cell Name: 0402_RESC100X50X35L25N; CmpIndex: 5; DXDB_LIBNAME: Resistors Surface Mount; Ref Designator: R4; SymIndex: 13; Orientation: 1 = 1; Part Label: 0402-10k-1%-1/16 W-100ppm; Part Name: 0402-10k-1%-1/16 W-100ppm; Part Number NP: 0402-10k-1%-1/16 W-100ppm; Part Number: 0402-10k-1%-1/16 W-100ppm

## Sheet PMIC.SchDoc
size 420 x 297 mm; CmpIndex: 74; SymIndex: 30

### Notes on the sheet
- Лист
- Изм.
- № Докум.
- Подп.
- Дата

## Sheet Power.SchDoc
size 420 x 297 mm; CmpIndex: 75; SymIndex: 30
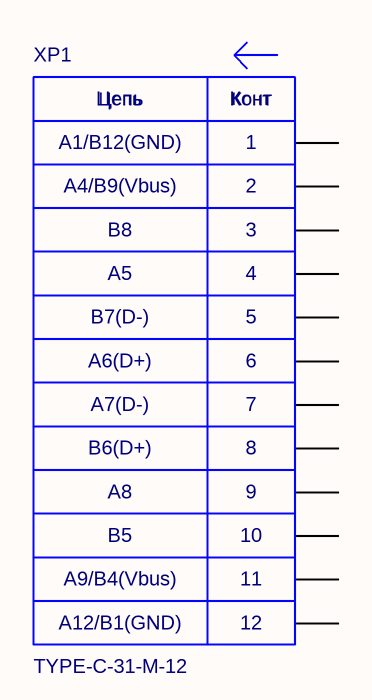
[diagram p4: Power.SchDoc]

### Parts
XP1  TYPE-C-31-M-12

### Nets

Not connected (* = marked no-connect by the designer): XP1 1 2 3 4 5 6 7 8 9 10 11 12

### Notes on the sheet
- Лист
- Изм.
- № Докум.
- Подп.
- Дата
- (in symbol TYPE-C-31-M-12) Цепь; Конт; A1/B12(GND); A4/B9(Vbus); B8; A5; B7(D-); A6(D+); A7(D-); B6(D+); A8; B5; A9/B4(Vbus); A12/B1(GND)

### Library data of the parts
XP1 = TYPE-C-31-M-12: CmpIndex: 40; DXDB_LIBNAME: Connectors USB; Ref Designator: XP1; SymIndex: 44; Orientation: 4 = 4; Part Label: TYPE-C-31-M-12; Part Name: TYPE-C-31-M-12; Part Number NP: TYPE-C-31-M-12; Part Number: TYPE-C-31-M-12

## Sheet Processor_1.SchDoc
size A3; CmpIndex: 3; SymIndex: 29
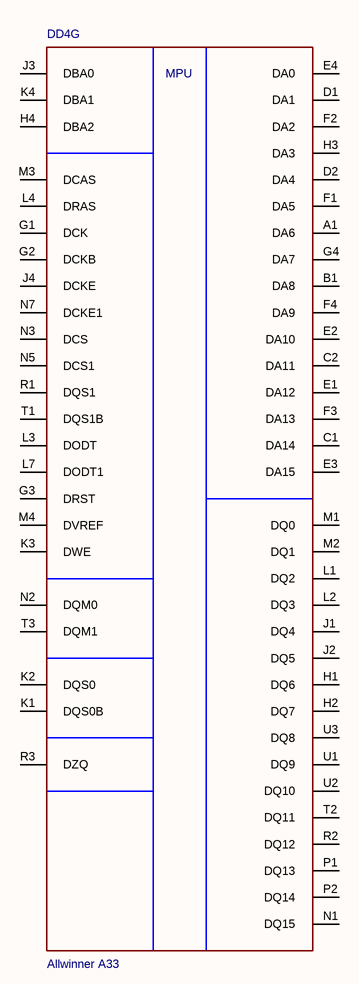
[diagram p5: Processor_1.SchDoc]

### Parts
DD4  Allwinner A33  (part G of 7)

### Nets

Not connected (* = marked no-connect by the designer): DD4 A1(DA6) B1(DA8) C1(DA14) C2(DA11) D1(DA1) D2(DA4) E1(DA12) E2(DA10) E3(DA15) E4(DA0) F1(DA5) F2(DA2) F3(DA13) F4(DA9) G1(DCK) G2(DCKB) G3(DRST) G4(DA7) H1(DQ6) H2(DQ7) H3(DA3) H4(DBA2) J1(DQ4) J2(DQ5) J3(DBA0) J4(DCKE) K1(DQS0B) K2(DQS0) K3(DWE) K4(DBA1) L1(DQ2) L2(DQ3) L3(DODT) L4(DRAS) L7(DODT1) M1(DQ0) M2(DQ1) M3(DCAS) M4(DVREF) N1(DQ15) N2(DQM0) N3(DCS) N5(DCS1) N7(DCKE1) P1(DQ13) P2(DQ14) R1(DQS1) R2(DQ12) R3(DZQ) T1(DQS1B) T2(DQ11) T3(DQM1) U1(DQ9) U2(DQ10) U3(DQ8)

### Notes on the sheet
- Лист
- Изм.
- № Докум.
- Подп.
- Дата
- (in symbol Allwinner A33, part G) MPU

### Library data of the parts
DD4 = Allwinner A33: CmpIndex: 80; DXDB_LIBNAME: Embedded Microprocessors; Ref Designator: DD4; SymIndex: 33; Orientation: 0 = 0; Part Label: Allwinner A33; Part Name: Allwinner A33; Part Number NP: Allwinner A33; Part Number: Allwinner A33

## Sheet USB_hub.SchDoc
size 209 x 297 mm; CmpIndex: 76; SymIndex: 29

### Notes on the sheet
- Лист
- Изм.
- № Докум.
- Подп.
- Дата

## Sheet Ethernet.SchDoc
size 420 x 297 mm; CmpIndex: 77; SymIndex: 30

### Notes on the sheet
- Лист
- Изм.
- № Докум.
- Подп.
- Дата

## Sheet Processor_power.SchDoc
size 420 x 297 mm; CmpIndex: 82; SymIndex: 30
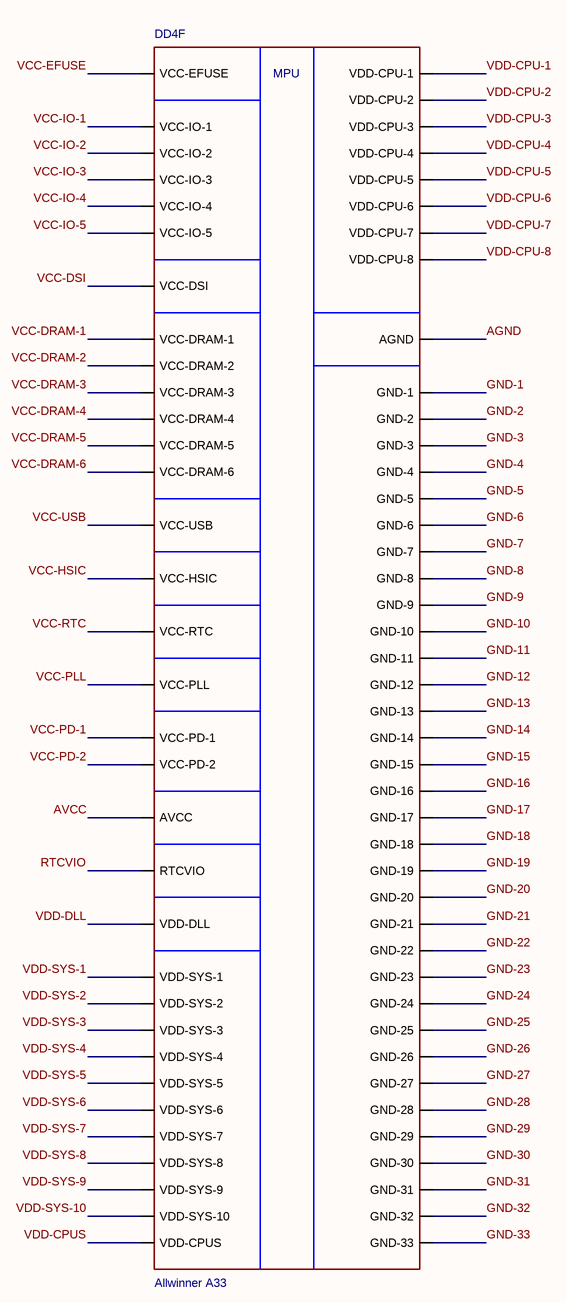
[diagram p6: Processor_power.SchDoc]

### Parts
DD4  Allwinner A33  (part F of 7)

### Nets
AGND: DD4.H13(AGND)
AVCC: DD4.L16(AVCC)
GND-1: DD4.N4(GND-1)
GND-2: DD4.F8(GND-2)
GND-3: DD4.F9(GND-3)
GND-4: DD4.F10(GND-4)
GND-5: DD4.G7(GND-5)
GND-6: DD4.G8(GND-6)
GND-7: DD4.G9(GND-7)
GND-8: DD4.G10(GND-8)
GND-9: DD4.G11(GND-9)
GND-10: DD4.H7(GND-10)
GND-11: DD4.H8(GND-11)
GND-12: DD4.H9(GND-12)
GND-13: DD4.H10(GND-13)
GND-14: DD4.H11(GND-14)
GND-15: DD4.H12(GND-15)
GND-16: DD4.J7(GND-16)
GND-17: DD4.J8(GND-17)
GND-18: DD4.J9(GND-18)
GND-19: DD4.J10(GND-19)
GND-20: DD4.J11(GND-20)
GND-21: DD4.J12(GND-21)
GND-22: DD4.K7(GND-22)
GND-23: DD4.K8(GND-23)
GND-24: DD4.K9(GND-24)
GND-25: DD4.K10(GND-25)
GND-26: DD4.K11(GND-26)
GND-27: DD4.K12(GND-27)
GND-28: DD4.L8(GND-28)
GND-29: DD4.L9(GND-29)
GND-30: DD4.L10(GND-30)
GND-31: DD4.L11(GND-31)
GND-32: DD4.M9(GND-32)
GND-33: DD4.M10(GND-33)
RTCVIO: DD4.M13(RTCVIO)
VCC-DRAM-1: DD4.H5(VCC-DRAM-1)
VCC-DRAM-2: DD4.J5(VCC-DRAM-2)
VCC-DRAM-3: DD4.K5(VCC-DRAM-3)
VCC-DRAM-4: DD4.L5(VCC-DRAM-4)
VCC-DRAM-5: DD4.H6(VCC-DRAM-5)
VCC-DRAM-6: DD4.J6(VCC-DRAM-6)
VCC-DSI: DD4.N6(VCC-DSI)
VCC-EFUSE: DD4.M8(VCC-EFUSE)
VCC-HSIC: DD4.N12(VCC-HSIC)
VCC-IO-1: DD4.E11(VCC-IO-1)
VCC-IO-2: DD4.E12(VCC-IO-2)
VCC-IO-3: DD4.F11(VCC-IO-3)
VCC-IO-4: DD4.F12(VCC-IO-4)
VCC-IO-5: DD4.G12(VCC-IO-5)
VCC-PD-1: DD4.M11(VCC-PD-1)
VCC-PD-2: DD4.N11(VCC-PD-2)
VCC-PLL: DD4.M5(VCC-PLL)
VCC-RTC: DD4.M12(VCC-RTC)
VCC-USB: DD4.L12(VCC-USB)
VDD-CPU-1: DD4.E5(VDD-CPU-1)
VDD-CPU-2: DD4.E6(VDD-CPU-2)
VDD-CPU-3: DD4.E7(VDD-CPU-3)
VDD-CPU-4: DD4.F5(VDD-CPU-4)
VDD-CPU-5: DD4.F6(VDD-CPU-5)
VDD-CPU-6: DD4.F7(VDD-CPU-6)
VDD-CPU-7: DD4.G5(VDD-CPU-7)
VDD-CPU-8: DD4.G6(VDD-CPU-8)
VDD-CPUS: DD4.M14(VDD-CPUS)
VDD-DLL: DD4.P3(VDD-DLL)
VDD-SYS-1: DD4.E8(VDD-SYS-1)
VDD-SYS-2: DD4.E9(VDD-SYS-2)
VDD-SYS-3: DD4.E10(VDD-SYS-3)
VDD-SYS-4: DD4.K6(VDD-SYS-4)
VDD-SYS-5: DD4.L6(VDD-SYS-5)
VDD-SYS-6: DD4.M6(VDD-SYS-6)
VDD-SYS-7: DD4.M7(VDD-SYS-7)
VDD-SYS-8: DD4.N8(VDD-SYS-8)
VDD-SYS-9: DD4.N9(VDD-SYS-9)
VDD-SYS-10: DD4.N10(VDD-SYS-10)

### Notes on the sheet
- Лист
- Изм.
- № Докум.
- Подп.
- Дата
- (in symbol Allwinner A33, part F) MPU

### Library data of the parts
DD4 = Allwinner A33: CmpIndex: 79; DXDB_LIBNAME: Embedded Microprocessors; Ref Designator: DD4; SymIndex: 32; Orientation: 0 = 0; Part Label: Allwinner A33; Part Name: Allwinner A33; Part Number NP: Allwinner A33; Part Number: Allwinner A33

## Sheet Processor_2.SchDoc
size 420 x 297 mm; CmpIndex: 87; SymIndex: 30
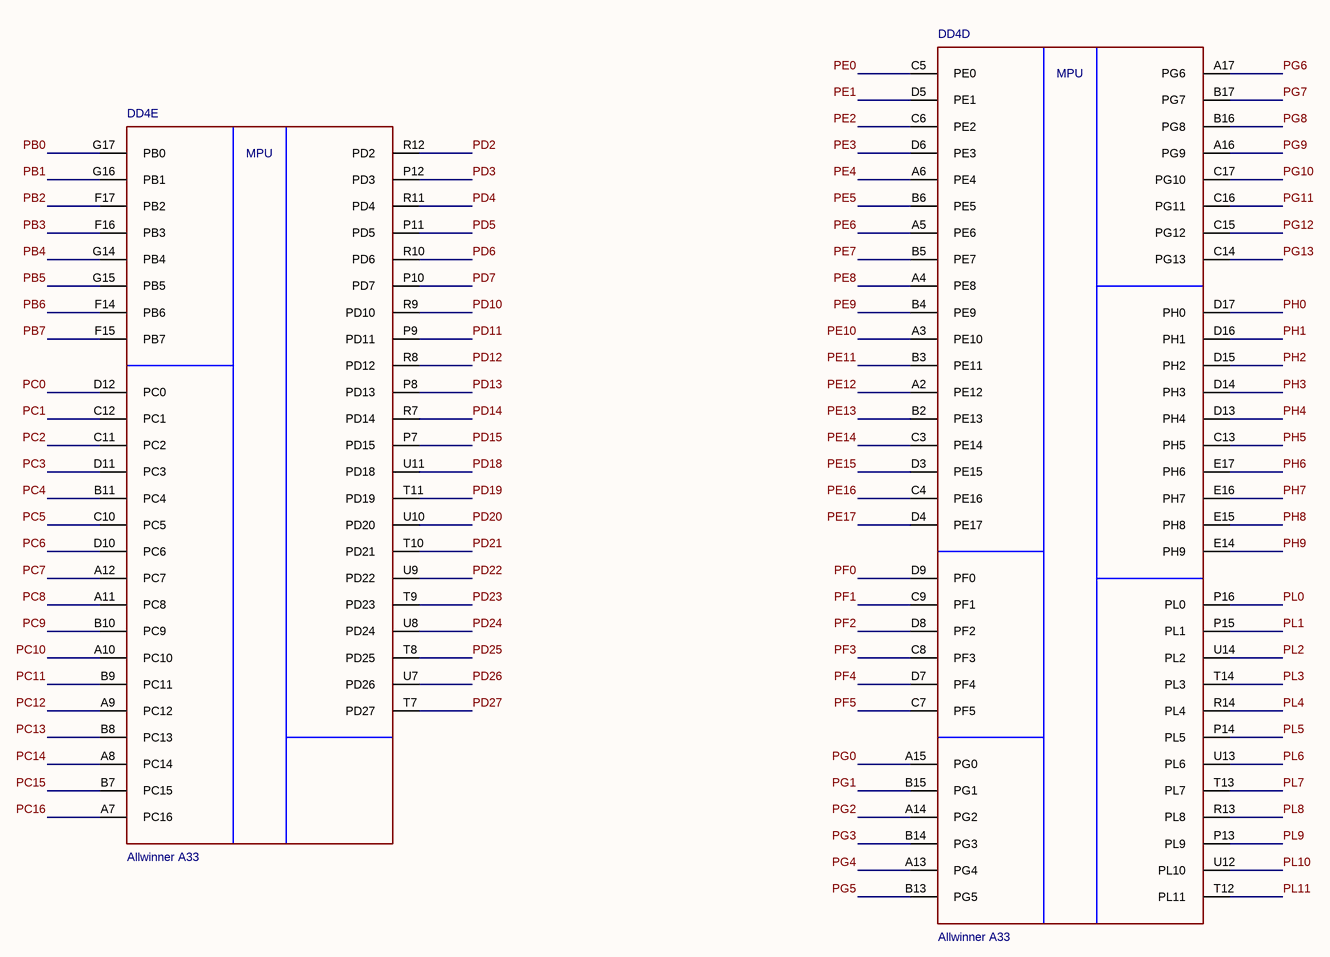
[diagram p7: Processor_2.SchDoc]

### Parts
DD4  Allwinner A33  (parts D,E of 7)

### Nets
PB0: DD4.G17(PB0)
PB1: DD4.G16(PB1)
PB2: DD4.F17(PB2)
PB3: DD4.F16(PB3)
PB4: DD4.G14(PB4)
PB5: DD4.G15(PB5)
PB6: DD4.F14(PB6)
PB7: DD4.F15(PB7)
PC0: DD4.D12(PC0)
PC1: DD4.C12(PC1)
PC2: DD4.C11(PC2)
PC3: DD4.D11(PC3)
PC4: DD4.B11(PC4)
PC5: DD4.C10(PC5)
PC6: DD4.D10(PC6)
PC7: DD4.A12(PC7)
PC8: DD4.A11(PC8)
PC9: DD4.B10(PC9)
PC10: DD4.A10(PC10)
PC11: DD4.B9(PC11)
PC12: DD4.A9(PC12)
PC13: DD4.B8(PC13)
PC14: DD4.A8(PC14)
PC15: DD4.B7(PC15)
PC16: DD4.A7(PC16)
PD2: DD4.R12(PD2)
PD3: DD4.P12(PD3)
PD4: DD4.R11(PD4)
PD5: DD4.P11(PD5)
PD6: DD4.R10(PD6)
PD7: DD4.P10(PD7)
PD10: DD4.R9(PD10)
PD11: DD4.P9(PD11)
PD12: DD4.R8(PD12)
PD13: DD4.P8(PD13)
PD14: DD4.R7(PD14)
PD15: DD4.P7(PD15)
PD18: DD4.U11(PD18)
PD19: DD4.T11(PD19)
PD20: DD4.U10(PD20)
PD21: DD4.T10(PD21)
PD22: DD4.U9(PD22)
PD23: DD4.T9(PD23)
PD24: DD4.U8(PD24)
PD25: DD4.T8(PD25)
PD26: DD4.U7(PD26)
PD27: DD4.T7(PD27)
PE0: DD4.C5(PE0)
PE1: DD4.D5(PE1)
PE2: DD4.C6(PE2)
PE3: DD4.D6(PE3)
PE4: DD4.A6(PE4)
PE5: DD4.B6(PE5)
PE6: DD4.A5(PE6)
PE7: DD4.B5(PE7)
PE8: DD4.A4(PE8)
PE9: DD4.B4(PE9)
PE10: DD4.A3(PE10)
PE11: DD4.B3(PE11)
PE12: DD4.A2(PE12)
PE13: DD4.B2(PE13)
PE14: DD4.C3(PE14)
PE15: DD4.D3(PE15)
PE16: DD4.C4(PE16)
PE17: DD4.D4(PE17)
PF0: DD4.D9(PF0)
PF1: DD4.C9(PF1)
PF2: DD4.D8(PF2)
PF3: DD4.C8(PF3)
PF4: DD4.D7(PF4)
PF5: DD4.C7(PF5)
PG0: DD4.A15(PG0)
PG1: DD4.B15(PG1)
PG2: DD4.A14(PG2)
PG3: DD4.B14(PG3)
PG4: DD4.A13(PG4)
PG5: DD4.B13(PG5)
PG6: DD4.A17(PG6)
PG7: DD4.B17(PG7)
PG8: DD4.B16(PG8)
PG9: DD4.A16(PG9)
PG10: DD4.C17(PG10)
PG11: DD4.C16(PG11)
PG12: DD4.C15(PG12)
PG13: DD4.C14(PG13)
PH0: DD4.D17(PH0)
PH1: DD4.D16(PH1)
PH2: DD4.D15(PH2)
PH3: DD4.D14(PH3)
PH4: DD4.D13(PH4)
PH5: DD4.C13(PH5)
PH6: DD4.E17(PH6)
PH7: DD4.E16(PH7)
PH8: DD4.E15(PH8)
PH9: DD4.E14(PH9)
PL0: DD4.P16(PL0)
PL1: DD4.P15(PL1)
PL2: DD4.U14(PL2)
PL3: DD4.T14(PL3)
PL4: DD4.R14(PL4)
PL5: DD4.P14(PL5)
PL6: DD4.U13(PL6)
PL7: DD4.T13(PL7)
PL8: DD4.R13(PL8)
PL9: DD4.P13(PL9)
PL10: DD4.U12(PL10)
PL11: DD4.T12(PL11)

### Notes on the sheet
- Лист
- Изм.
- № Докум.
- Подп.
- Дата
- (in symbol Allwinner A33, part D) MPU
- (in symbol Allwinner A33, part E) MPU

### Library data of the parts
DD4 = Allwinner A33: CmpIndex: 83; DXDB_LIBNAME: Embedded Microprocessors; Ref Designator: DD4; SymIndex: 35; Orientation: 0 = 0; Part Label: Allwinner A33; Part Name: Allwinner A33; Part Number NP: Allwinner A33; Part Number: Allwinner A33

## Sheet Processor_3.SchDoc
size 420 x 297 mm; CmpIndex: 88; SymIndex: 30
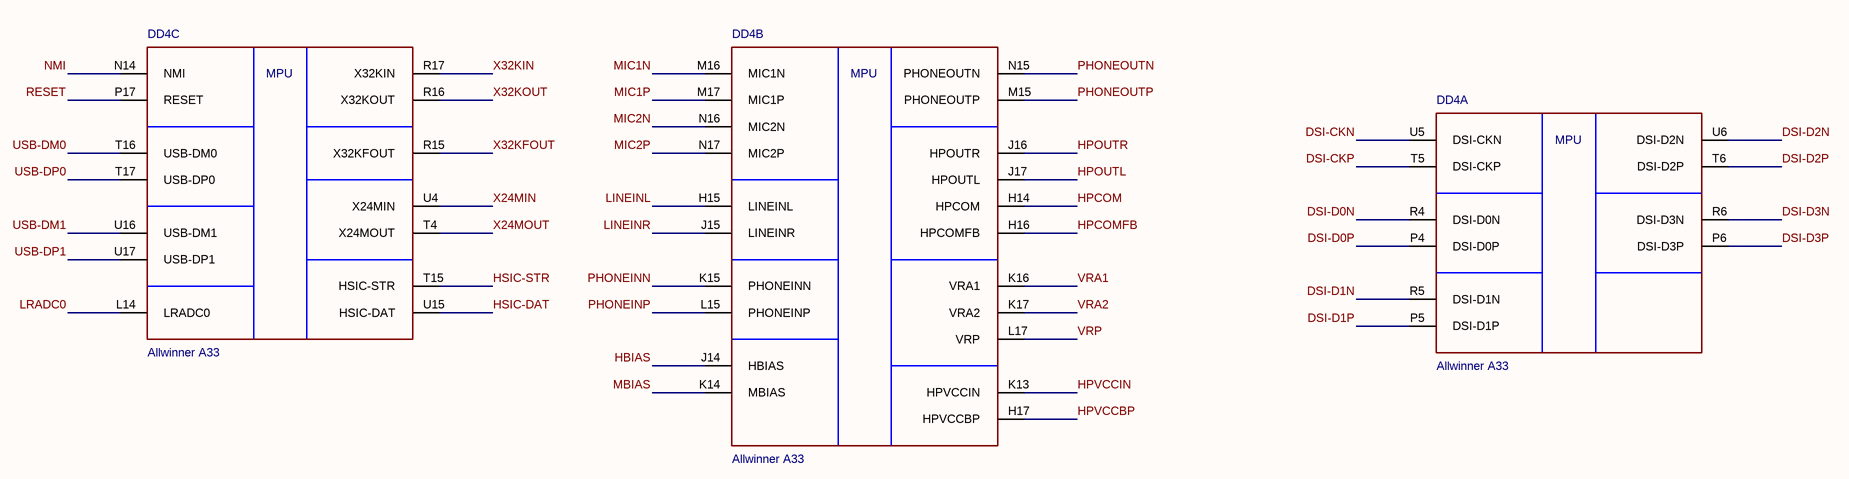
[diagram p8: Processor_3.SchDoc]

### Parts
DD4  Allwinner A33  (parts A,B,C of 7)

### Nets
DSI-CKN: DD4.U5(DSI-CKN)
DSI-CKP: DD4.T5(DSI-CKP)
DSI-D0N: DD4.R4(DSI-D0N)
DSI-D0P: DD4.P4(DSI-D0P)
DSI-D1N: DD4.R5(DSI-D1N)
DSI-D1P: DD4.P5(DSI-D1P)
DSI-D2N: DD4.U6(DSI-D2N)
DSI-D2P: DD4.T6(DSI-D2P)
DSI-D3N: DD4.R6(DSI-D3N)
DSI-D3P: DD4.P6(DSI-D3P)
HBIAS: DD4.J14(HBIAS)
HPCOM: DD4.H14(HPCOM)
HPCOMFB: DD4.H16(HPCOMFB)
HPOUTL: DD4.J17(HPOUTL)
HPOUTR: DD4.J16(HPOUTR)
HPVCCBP: DD4.H17(HPVCCBP)
HPVCCIN: DD4.K13(HPVCCIN)
HSIC-DAT: DD4.U15(HSIC-DAT)
HSIC-STR: DD4.T15(HSIC-STR)
LINEINL: DD4.H15(LINEINL)
LINEINR: DD4.J15(LINEINR)
LRADC0: DD4.L14(LRADC0)
MBIAS: DD4.K14(MBIAS)
MIC1N: DD4.M16(MIC1N)
MIC1P: DD4.M17(MIC1P)
MIC2N: DD4.N16(MIC2N)
MIC2P: DD4.N17(MIC2P)
NMI: DD4.N14(NMI)
PHONEINN: DD4.K15(PHONEINN)
PHONEINP: DD4.L15(PHONEINP)
PHONEOUTN: DD4.N15(PHONEOUTN)
PHONEOUTP: DD4.M15(PHONEOUTP)
RESET: DD4.P17(RESET)
USB-DM0: DD4.T16(USB-DM0)
USB-DM1: DD4.U16(USB-DM1)
USB-DP0: DD4.T17(USB-DP0)
USB-DP1: DD4.U17(USB-DP1)
VRA1: DD4.K16(VRA1)
VRA2: DD4.K17(VRA2)
VRP: DD4.L17(VRP)
X24MIN: DD4.U4(X24MIN)
X24MOUT: DD4.T4(X24MOUT)
X32KFOUT: DD4.R15(X32KFOUT)
X32KIN: DD4.R17(X32KIN)
X32KOUT: DD4.R16(X32KOUT)

### Notes on the sheet
- Лист
- Изм.
- № Докум.
- Подп.
- Дата
- (in symbol Allwinner A33, part A) MPU
- (in symbol Allwinner A33, part B) MPU
- (in symbol Allwinner A33, part C) MPU

### Library data of the parts
DD4 = Allwinner A33: CmpIndex: 86; DXDB_LIBNAME: Embedded Microprocessors; Ref Designator: DD4; SymIndex: 38; Orientation: 0 = 0; Part Label: Allwinner A33; Part Name: Allwinner A33; Part Number NP: Allwinner A33; Part Number: Allwinner A33

## Sheet HDMI.SchDoc
size 420 x 297 mm; CmpIndex: 89; SymIndex: 30

### Notes on the sheet
- Лист
- Изм.
- № Докум.
- Подп.
- Дата

## Sheet Wi_Fi.SchDoc
size 209 x 297 mm; CmpIndex: 90; SymIndex: 29
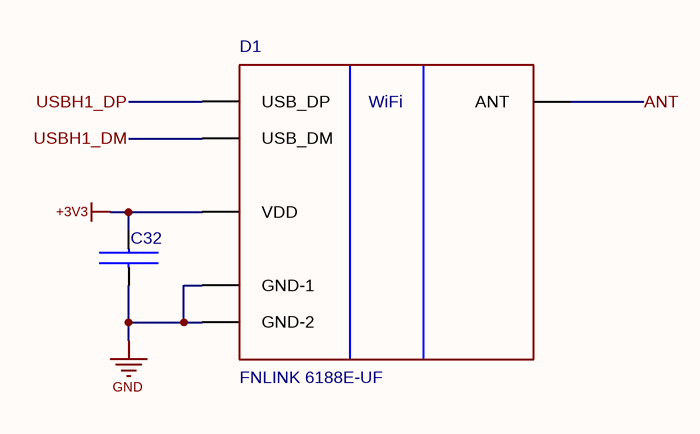
[diagram p9: Wi_Fi.SchDoc]

### Parts
C32  0603-1uF-16V-10%-X7R  (value not drawn)
D1  FNLINK 6188E-UF

### Nets
+3V3: C32.2 D1.3(VDD)
GND: C32.1 D1.1(GND-2) D1.6(GND-1)
ANT: D1.2(ANT)
USBH1_DM: D1.4(USB_DM)
USBH1_DP: D1.5(USB_DP)

### Notes on the sheet
- Лист
- Изм.
- № Докум.
- Подп.
- Дата
- (in symbol FNLINK 6188E-UF) WiFi

### Library data of the parts
C32 = 0603-1uF-16V-10%-X7R: CmpIndex: 33; DXDB_LIBNAME: Capacitors Ceramic SMD; Ref Designator: C32; SymIndex: 25; Tolerance: 10%; Orientation: 1 = 1; Part Label: 0603-1uF-16V-10%-X7R; Part Name: 0603-1uF-16V-10%-X7R; Part Number NP: 0603-1uF-16V-10%-X7R; Part Number: 0603-1uF-16V-10%-X7R
D1 = FNLINK 6188E-UF: CmpIndex: 29; DXDB_LIBNAME: Modules RF; Ref Designator: D1; SymIndex: 43; Orientation: 0 = 0; Part Label: FNLINK 6188E-UF; Part Name: FNLINK 6188E-UF; Part Number NP: FNLINK 6188E-UF; Part Number: FNLINK 6188E-UF

## Nets that join several sheets
+3V3: SD_card (8 pins), NAND_Flash (6 pins), Wi_Fi (C32.2 D1.3)
GND: SD_card (6 pins), SDRAM (50 pins), NAND_Flash (C30.1 C31.1 DD3.13 DD3.36), Wi_Fi (C32.1 D1.1 D1.6)

## Assembly variants
00: not fitted C6